# Altium schematic sheet LDO_AUX.SchDoc
size B; SheetNumber: 3; SheetTotal: 15
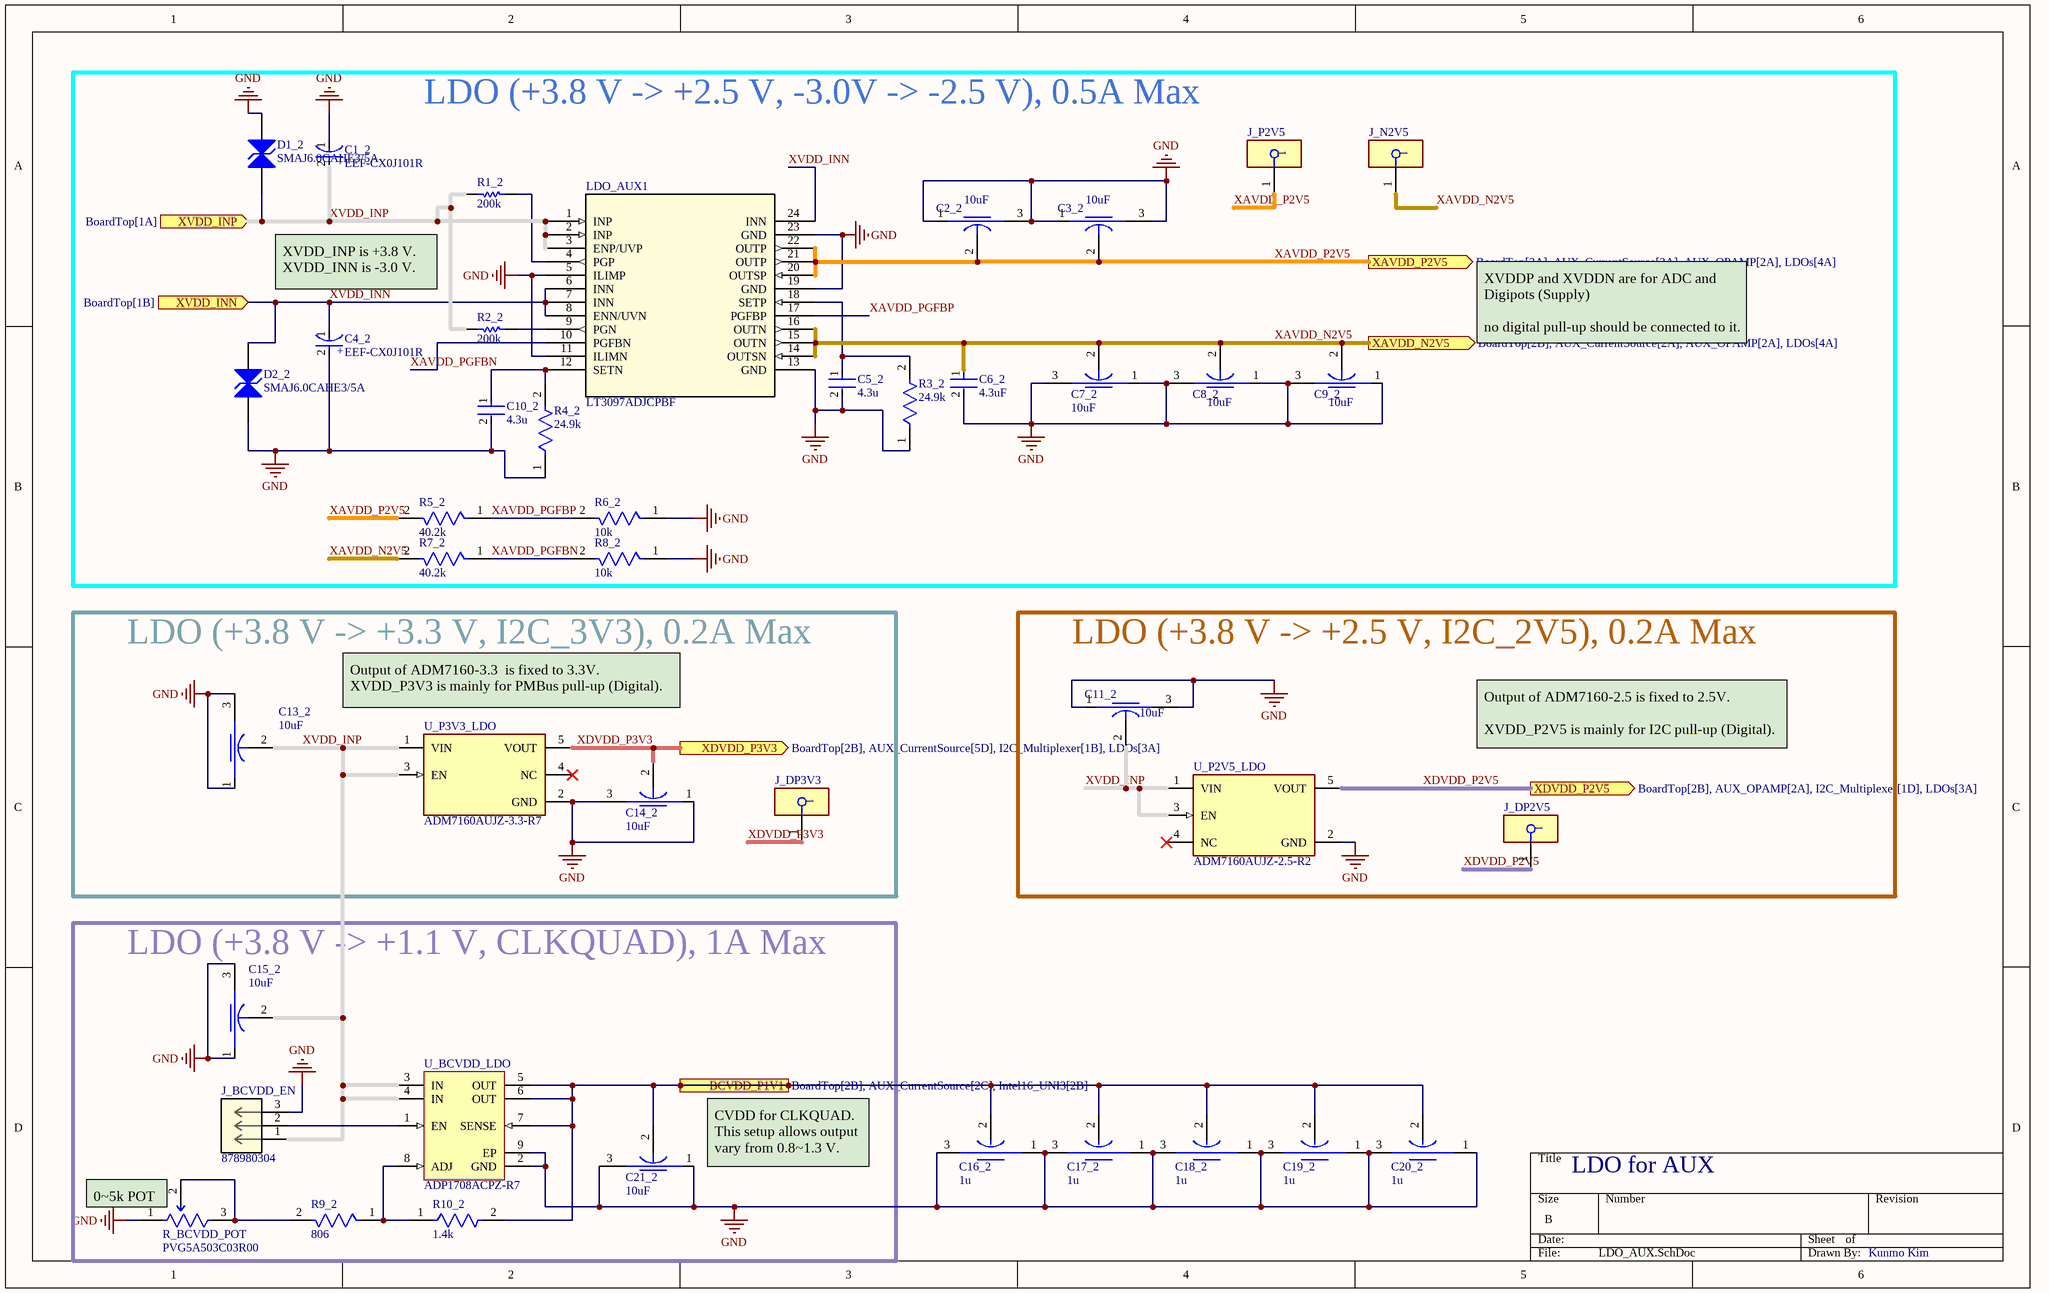
[diagram p0: LDO_AUX.SchDoc]

## Parts
C1_2  EEF-CX0J101R  [FP-CX-MFG]
C2_2  10uF  [FP-NFM15-0_2-MFG]
C3_2  10uF  [FP-NFM15-0_2-MFG]
C4_2  EEF-CX0J101R  [FP-CX-MFG]
C5_2  4.3u  [FP-LLL1U4-0_05-IPC_C]
C6_2  4.3uF  [FP-LLL1U4-0_05-MFG]
C7_2  10uF  [FP-NFM15-0_2-MFG]
C8_2  10uF  [FP-NFM15-0_2-MFG]
C9_2  10uF  [FP-NFM15-0_2-MFG]
C10_2  4.3u  [FP-LLL1U4-0_05-IPC_C]
C11_2  10uF  [FP-NFM15-0_2-MFG]
C13_2  10uF  [FP-NFM15-0_2-MFG]
C14_2  10uF  [FP-NFM15-0_2-MFG]
C15_2  10uF  [FP-NFM15-0_2-MFG]
C16_2  1u  [PCBComponent_1]
C17_2  1u  [PCBComponent_1]
C18_2  1u  [PCBComponent_1]
C19_2  1u  [PCBComponent_1]
C20_2  1u  [PCBComponent_1]
C21_2  10uF  [FP-NFM15-0_2-MFG]
D1_2  SMAJ6.0CAHE3/5A  [VISH-DO-214AC-2_L]
D2_2  SMAJ6.0CAHE3/5A  [VISH-DO-214AC-2_L]
J_BCVDD_EN  878980304  [CONN03_87898_M-5p84_MOL]
J_DP2V5  5019  [FP-5019-MFG]  (value not drawn)
J_DP3V3  5019  [FP-5019-MFG]  (value not drawn)
J_N2V5  5019  [FP-5019-MFG]  (value not drawn)
J_P2V5  5019  [FP-5019-MFG]  (value not drawn)
LDO_AUX1  LT3097ADJCPBF  [05-08-7071_ADI]
R1_2  200k  [RESC1005X40X25NL05T05]
R2_2  200k  [RESC1005X40X25NL05T05]
R3_2  24.9k  [FP-ERJ2RK-MFG]
R4_2  24.9k  [FP-ERJ2RK-MFG]
R5_2  40.2k  [FP-ERJ2RK-MFG]
R6_2  10k  [FP-ERA2A-MFG]
R7_2  40.2k  [FP-ERJ2RK-MFG]
R8_2  10k  [FP-ERA2A-MFG]
R9_2  806  [FP-ERJ2RK-MFG]
R10_2  1.4k  [FP-RT0603-MFG]
R_BCVDD_POT  PVG5A503C03R00  [FP-PVG5A-MFG]
U_BCVDD_LDO  ADP1708ACPZ-R7  [ADI-CP-8-2_N]
U_P2V5_LDO  ADM7160AUJZ-2.5-R2  [FP-UJ-5-IPC_A]
U_P3V3_LDO  ADM7160AUJZ-3.3-R7  [FP-UJ-5-IPC_A]

## Blocks framed on the sheet
LDO (+3.8 V -> +2.5 V, -3.0V -> -2.5 V), 0.5A Max: C1_2 C2_2 C3_2 C4_2 C5_2 C6_2 C7_2 C8_2 C9_2 C10_2 D1_2 D2_2 J_N2V5 J_P2V5 LDO_AUX1 R1_2 R2_2 R3_2 R4_2 R5_2 R6_2 R7_2 R8_2
LDO (+3.8 V -> +3.3 V, I2C_3V3), 0.2A Max: C13_2 C14_2 J_DP3V3 U_P3V3_LDO
LDO (+3.8 V -> +2.5 V, I2C_2V5), 0.2A Max: C11_2 J_DP2V5 U_P2V5_LDO
LDO (+3.8 V -> +1.1 V, CLKQUAD), 1A Max: C15_2 C21_2 J_BCVDD_EN R9_2 R10_2 R_BCVDD_POT U_BCVDD_LDO

## Ports
BCVDD_P1V1 (out, see BoardTop[2B], AUX_CurrentSource[2C], Intel16_UNI3[2B]), XAVDD_N2V5 (out, see BoardTop[2B], AUX_CurrentSource[2A], AUX_OPAMP[2A], LDOs[4A]), XAVDD_P2V5 (out, see BoardTop[2A], AUX_CurrentSource[2A], AUX_OPAMP[2A], LDOs[4A]), XDVDD_P2V5 (out, see BoardTop[2B], AUX_OPAMP[2A], I2C_Multiplexer[1D], LDOs[3A]), XDVDD_P3V3 (out, see BoardTop[2B], AUX_CurrentSource[5D], I2C_Multiplexer[1B], LDOs[3A]), XVDD_INN (in, see BoardTop[1B]), XVDD_INP (in, see BoardTop[1A])

## Nets
GND: C1_2.1(C) C2_2.1(Input) C2_2.3(Output) C3_2.1(Input) C3_2.3(Output) C4_2.2(A) C5_2.2 C6_2.2 C7_2.1(Input) C7_2.3(Output) C8_2.1(Input) C8_2.3(Output) C9_2.1(Input) C9_2.3(Output) C10_2.2 C11_2.1(Input) C11_2.3(Output) C13_2.1(Input) C13_2.3(Output) C14_2.1(Input) C14_2.3(Output) C15_2.1(Input) C15_2.3(Output) C16_2.1(Input) C16_2.3(Output) C17_2.1(Input) C17_2.3(Output) C18_2.1(Input) C18_2.3(Output) C19_2.1(Input) C19_2.3(Output) C20_2.1(Input) C20_2.3(Output) C21_2.1(Input) C21_2.3(Output) D1_2.2(A2) D2_2.1(A1) J_BCVDD_EN.3 LDO_AUX1.5(ILIMP) LDO_AUX1.11(ILIMN) LDO_AUX1.13(GND) LDO_AUX1.19(GND) LDO_AUX1.23(GND) R3_2.1 R4_2.1 R6_2.1 R8_2.1 R_BCVDD_POT.1(CCW) U_BCVDD_LDO.2(GND) U_BCVDD_LDO.9(EP) U_P2V5_LDO.2(GND) U_P3V3_LDO.2(GND)
BCVDD_P1V1: C16_2.2(GND) C17_2.2(GND) C18_2.2(GND) C19_2.2(GND) C20_2.2(GND) C21_2.2(GND) R10_2.2 U_BCVDD_LDO.5(OUT) U_BCVDD_LDO.6(OUT) U_BCVDD_LDO.7(SENSE) ; port BCVDD_P1V1
XAVDD_N2V5: C6_2.1 C7_2.2(GND) C8_2.2(GND) C9_2.2(GND) J_N2V5.1 LDO_AUX1.14(OUTSN) LDO_AUX1.15(OUTN) LDO_AUX1.16(OUTN) R7_2.2 ; port XAVDD_N2V5
XAVDD_P2V5: C2_2.2(GND) C3_2.2(GND) J_P2V5.1 LDO_AUX1.20(OUTSP) LDO_AUX1.21(OUTP) LDO_AUX1.22(OUTP) R5_2.2 ; port XAVDD_P2V5
XAVDD_PGFBN: LDO_AUX1.10(PGFBN) R7_2.1 R8_2.2
XAVDD_PGFBP: LDO_AUX1.17(PGFBP) R5_2.1 R6_2.2
XDVDD_P2V5: J_DP2V5.1 U_P2V5_LDO.5(VOUT) ; port XDVDD_P2V5
XDVDD_P3V3: C14_2.2(GND) J_DP3V3.1 U_P3V3_LDO.5(VOUT) ; port XDVDD_P3V3
XVDD_INN: C4_2.1(C) D2_2.2(A2) LDO_AUX1.6(INN) LDO_AUX1.7(INN) LDO_AUX1.8(ENN/UVN) LDO_AUX1.24(INN) ; port XVDD_INN
XVDD_INP: C1_2.2(A) C11_2.2(GND) C13_2.2(GND) C15_2.2(GND) D1_2.1(A1) J_BCVDD_EN.1 LDO_AUX1.1(INP) LDO_AUX1.2(INP) LDO_AUX1.3(ENP/UVP) R1_2.2 R2_2.2 U_BCVDD_LDO.3(IN) U_BCVDD_LDO.4(IN) U_P2V5_LDO.1(VIN) U_P2V5_LDO.3(EN) U_P3V3_LDO.1(VIN) U_P3V3_LDO.3(EN) ; port XVDD_INP
NetC5_2_1: C5_2.1 LDO_AUX1.18(SETP) R3_2.2
NetC10_2_1: C10_2.1 LDO_AUX1.12(SETN) R4_2.2
NetJ_BCVDD_EN_2: J_BCVDD_EN.2 U_BCVDD_LDO.1(EN)
NetLDO_AUX1_4: LDO_AUX1.4(PGP) R1_2.1
NetLDO_AUX1_9: LDO_AUX1.9(PGN) R2_2.1
NetR9_2_1: R9_2.1 R10_2.1 U_BCVDD_LDO.8(ADJ)
NetR9_2_2: R9_2.2 R_BCVDD_POT.2(WIPER) R_BCVDD_POT.3(CW)

Not connected (* = marked no-connect by the designer): U_P2V5_LDO 4(NC)*; U_P3V3_LDO 4(NC)*

## Notes on the sheet
- XVDD_INP is +3.8 V.
  XVDD_INN is -3.0 V.
- XVDDP and XVDDN are for ADC and Digipots (Supply)
  no digital pull-up should be connected to it.
- (near U_P3V3_LDO) Output of ADM7160-3.3  is fixed to 3.3V.
  XVDD_P3V3 is mainly for PMBus pull-up (Digital).
- Output of ADM7160-2.5 is fixed to 2.5V.
  XVDD_P2V5 is mainly for I2C pull-up (Digital).
- (near C21_2) CVDD for CLKQUAD.
  This setup allows output
  vary from 0.8~1.3 V.
- LDO for AUX
- (near R_BCVDD_POT) 0~5k POT
- Kunmo Kim
- (in symbol CMP-05427-000056-1) +

## Library data of the parts
C1_2 C4_2 = CMP-05427-000056-1: CAP ALUM POLY 100UF 20% 6.3V SMD; Leakage Current: 63uA; Polarity: Polar; Lead Diameter: 2.4mm; Dissipation Factor: 0.06%; Ripple Current: 2.7A; ESR (Equivalent Series Resistance): 15mR; Life (Hours): 1000Hour; Voltage Rating: 6.3V; Case/Package: 2917; Lead Pitch: 1.3mm; Series: SP-Cap CX; Weight: 0.004586oz; Radiation Hardening: No; Case Code (Imperial): 2917; Length: 7.3mm; Number of Pins: 2; Lead Free: Lead Free; REACH SVHC: No SVHC; Max Operating Temperature: 105°C; Package Quantity: 3500; Packaging: Tape and Reel; Height - Seated (Max): 0.075inch; Mount: Surface Mount; Height: 1.9mm; Termination: SMD/SMT; Voltage: 6.3V; Construction: Flat; Width: 0.169inch; Ripple Current (AC): 2.7A; Capacitance: 100uF; Voltage Rating (DC): 6.3V; Case Code (Metric): 7343; Min Operating Temperature: -40°C; Tolerance: 20%; RoHS Compliant: Yes; Depth: 4.3mm
C2_2 C3_2 C7_2 C8_2 C9_2 C11_2 C13_2 C14_2 C15_2 C21_2 = CMP-06053-000058-1: CAP FEEDTHRU
C5_2 C6_2 C10_2 = CMP-06035-061933-1: Cap Ceramic Monolithic 4.3uF 20% 4V X5R 15% 02404 (0610M); Capacitance: 4.3uF; Tolerance: 20%; Voltage Rating: 4V; Min Operating Temperature: -55°C; Case/Package: 0204; Mount: Surface Mount; Max Operating Temperature: 85°C; Packaging: Tape and Reel; RoHS Compliant: Yes
C16_2 C17_2 C18_2 C19_2 C20_2 = CMP-06053-000757-1: 0402(1005M) 4V 1.0UF +/- 20% 3 T; Capacitance: 1uF; Current: 2A; Case/Package: 0402; Max Operating Temperature: 125°C; Min Operating Temperature: -55°C; Mount: Surface Mount; Ratings: AEC-Q200; Series: EMIFIL®, NFM15; Tolerance: 20%; Voltage Rating: 4V; Supplier 1: Mouser; Supplier Part Number 1: 81-NFM15HC105D0G3D
D1_2 D2_2 = CMP-0548-00108-2: Transient Voltage Suppressor, 6.40 to 231 V, 6 V Stand-off Voltage, Bi-Directional, -55 to 155 degC, 2-pin DO-214AC, Pb-Free, Tape and Reel; Manufacturer: Vishay Semiconductor; VBR Bi-Directional (V): 6.4 to 231; VWM (V): 6; IFSM: 40 A; ID (uA): 1600; PPPM (W): 400, 300; PackageDescription: 2-Pin DO-214AC (SMA), Body 4.245 x 2.665 mm; Packing: Tape and Reel; RoHS: TRUE; ComponentLink3Description: Package Specification; ComponentLink2Description: Datasheet; Mounting Technology: Surface Mount; Operating Junction and Storage Temperature Range: -55 to 150 degC; ComponentLink2URL: http://www.vishay.com/docs/88390/smaj50a.pdf; ComponentLink1Description: Manufacturer URL; DatasheetVersion: 12/8/2013; PackageReference: DO-214AC-2; ComponentLink3URL: http://www.vishay.com/docs/88390/smaj50a.pdf; PartNumber: SMAJ6.0CAHE3/5A; ComponentLink1URL: http://www.vishay.com/; Supplier 1: Mouser; Supplier Part Number 1: 78-SMAJ6.0CAHE3_A/H
J_BCVDD_EN = 878980304: No Description Available; Mfr_Name: Molex Connector Corporation; RefDes: RefDes; Type: Type
J_DP2V5 J_DP3V3 J_N2V5 J_P2V5 = CMP-1672-00008-2: NexarPartId: 22052288; Number of Contacts: 1; Contact Material: Bronze, Silver; Number of Pins: 1; Lead Free: Lead Free; Packaging: Tape and Reel; Mount: Surface Mount; Height: 2.286mm; Contact Plating: Silver; Material: Bronze; Termination: SMD/SMT; REACH SVHC: No SVHC; RoHS: Compliant
LDO_AUX1 = LT3097ADJCPBF: No Description Available; Mfr_Name: Analog Devices Inc; Type: Power Management; RefDes: RefDes; Supplier 1: Mouser; Supplier Part Number 1: 584-LT3097ADJC#PBF
R1_2 R2_2 = CMP-1011-00768-4: Chip Resistor, 200 KOhm, +/- 1%, 100 mW, -55 to 155 degC, 0402 (1005 Metric), RoHS, Tape and Reel; PartNumber: ERJ-2RKF2003X; Manufacturer: Basic Passives; Case\/Package: 0402; Voltage Rating: 50 V; Power Rating: 100 mW; RoHSCompliant: true; Length: 1 mm; DatasheetVersion: 04/2015; ComponentLink2URL: http://industrial.panasonic.com/cdbs/www-data/pdf/RDA0000/AOA0000C86.pdf; Mount: Surface Mount; PackageDescription: 2-Pin Surface Mount Device, Body 1 x 0.5 mm; Tolerance: 1%; Width: 0.5 mm; ComponentLink2Description: Datasheet; Packaging: Tape and Reel; REACH SVHC: No SVHC; Min Operating Temperature: -55 degC; Package Quantity: 10000; ComponentLink1Description: Manufacturer URL; Height: 0.35 mm; ComponentLink1URL: http://www.panasonic.com/; Mounting Technology: Surface Mount; Case Code (Imperial): 0402; PackageReference: 0402; Radiation Hardening: No; Pins: 2; Max Operating Temperature: 155 degC; Resistance: 200 KOhm; Case Code (Metric): 1005
R3_2 R4_2 = CMP-2002-00806-2: RES SMD 24.9K OHM 1% 1/10W 0402; Voltage Rating (DC): 50V; Temperature Coefficient: 100ppm/°C; Max Power Dissipation: 100mW; Resistance: 24.9kR; Size Code: 0402; Series: ERJ; Package Quantity: 1; Packaging: Tape and Reel; Lead Free: Lead Free; Mount: Surface Mount; Construction: Rectangular; Depth: 0.5mm; Contact Plating: Tin; Length: 1mm; Termination: SMD/SMT; Height: 0.016inch; Military Standard: Not; Voltage Rating: 50V; Resistor Type: Thick Film; Number of Terminations: 2; Case/Package: 0402; REACH SVHC: No SVHC; Case Code (Metric): 1005; Power Rating: 100mW; Tolerance: 1%; Weight: 2.8E-05oz; RoHS Compliant: Yes; Case Code (Imperial): 0402; Max Operating Temperature: 155°C; Features: Automotive AEC-Q200; Width: 0.02inch; Resistance Tolerance: 1%; Min Operating Temperature: -55°C
R5_2 R7_2 = CMP-2002-00919-2: RES SMD 40.2K OHM 1% 1/10W 0402; Max Power Dissipation: 100mW; Voltage Rating (DC): 50V; Temperature Coefficient: 100ppm/°C; Resistance: 40.2kR; Case Code (Metric): 1005; REACH SVHC: No SVHC; Height: 0.35mm; Mount: Surface Mount; Series: ERJ; Width: 0.02inch; Contact Plating: Tin; Number of Terminations: 2; Max Operating Temperature: 155°C; Length: 1mm; Case Code (Imperial): 0402; Construction: Rectangular; Depth: 0.5mm; Features: Automotive AEC-Q200; Weight: 2.8E-05oz; Power Rating: 100mW; Lead Free: Lead Free; Case/Package: 0402; Resistor Type: Thick Film; Termination: SMD/SMT; Voltage Rating: 50V; Package Quantity: 1; Packaging: Tape and Reel; Min Operating Temperature: -55°C; Resistance Tolerance: 1%; Military Standard: Not; Tolerance: 1%; Technology: THICK FILM; RoHS Compliant: Yes
R6_2 R8_2 = CMP-2002-05875-2: RES SMD 10K OHM 0.1% 1/16W 0402; Manufacturer Part Number: ERA-2AEB103X; Manufacturer: Panasonic; Temperature Coefficient: 25ppm/°C; Automotive Grade: Grade 0; Resistance: 10kΩ; Power Rating: 0.063W; Voltage Rating: 50V; Value: 10kΩ; RoHS: TRUE; Device Class L3: Chip SMD Resistors; Automotive: Yes; Series: ERA; Height: 0.4mm; Package: ERA2A; Temperature Range Low: -55°C; ComponentLink2Description: Datasheet; Tolerance: 0.1%; Device Class L2: Resistors; Temperature Range High: +155°C; Device Class L1: Passive Components; Digikey Description: RES SMD 10K OHM 0.1% 1/16W 0402; Category: Res; Mouser Description: Thin Film Resistors - SMD 0402 1/16W 10Kohms; Lead Free: Yes; Footprint Url: https://industrial.panasonic.com/cdbs/www-data/pdf/RDM0000/DMM0000COL17.pdf; Composition: Metal Film; Octopart: https://octopart.com/era-2aeb103x-panasonic-9251377; ComponentLink2URL: https://industrial.panasonic.com/cdbs/www-data/pdf/RDM0000/AOA0000C307.pdf; Temperature: -55°C to +155°C
R9_2 = CMP-2002-01074-4: RES SMD 80.6K OHM 1% 1/10W 0402; NexarPartId: 55421299; Max Power Dissipation: 100mW; Temperature Coefficient: 100ppm/°C; Voltage Rating: 50V; Resistance: 80.6kΩ; Length: 1mm; Number of Terminations: 2; REACH SVHC: No SVHC; Composition: Thick Film; Case Code (Imperial): 0402; RoHS: Compliant; Max Operating Temperature: 155°C; Military Standard: Not; Case Code (Metric): 1005; Depth: 500µm; Termination: SMD/SMT; Contact Plating: Tin; Tolerance: 1%; Voltage Rating (DC): 50V; Min Operating Temperature: -55°C; Case/Package: 0402; Schedule B: 8533210045, 8533210045; Height: 400µm; Power Rating: 100mW; Packaging: Cut Tape (CT); Features: Automotive AEC-Q200; Lead Free: Lead Free; Width: 508µm; Lifecycle Status: Production; Mount: Surface Mount
R10_2 = CMP-03412-033782-1: RES SMD 1.4K OHM 0.1% 1/10W 0603; Manufacturer Part Number: RT0603BRD071K4L; Manufacturer: Yageo; Tolerance: 0.001; Voltage Rating: 75V; Temperature Coefficient: 25 ppm/°C; Resistance: 1.4KΩ; Value: 1.4KΩ; Power Rating: 0.1W; Device Class L3: Chip SMD Resistors; Package: RT0603; RoHS: TRUE; Lead Free: Yes; Footprint Url: http://www.yageo.com/exep/pages/download/literatures/PYu-R_Mount_10.pdf; Device Class L2: Resistors; Ipc Land Pattern Name: RESC16080X45; Digikey Description: RES SMD 1.4K OHM 0.1% 1/10W 0603; ComponentLink2Description: Datasheet; Category: Res; Mouser Description: Res Thin Film 0603 1.4k Ohm 0.1% 1/10W ±25ppm/°C Molded SMD Paper T/R; Temperature: -55°C to +155°C; Temperature Range High: +155°C; Octopart: https://octopart.com/rt0603brd071k4l-yageo-1419726; Device Class L1: Passive Components; ComponentLink2URL: http://www.yageo.com/documents/recent/PYu-RT_1-to-0.01_RoHS_L_9.pdf; Series: RT; Height: 0.55mm; Composition: Thin Film; Temperature Range Low: -55°C; Automotive: No
R_BCVDD_POT = CMP-00059-71526922-1: PVG5A502C03R00 Resistor Trimmer, Cermet, 5 kOhm, ± 10%, 250 mW, 12 Turn, Multi Turn, Surface Mount; Temperature Coefficient: 150ppm/°C; Power Rating: 250mW; Resistance: 5kΩ; Number of Turns: 11; Schedule B: 8533400080, 8533400080|8533400080|8533400080|8533400080|8533400080; RoHS: Compliant; Height: 5.1054mm; Max Operating Temperature: 125°C; Min Operating Temperature: -55°C; Mount: Surface Mount; Max Power Dissipation: 250mW; NexarPartId: 71526922; Tolerance: 10%; Composition: Cermet
U_BCVDD_LDO = CMP-0786-00092-1: 1 A, Low Dropout, CMOS Linear Regulator, 2.5 to 5.5 V Vin, 0.8 to 5 V Vout, Industrial, 8-pin QFN (CP-8-2), Reel; Manufacturer: Analog Devices; Vin (max) (V): 5.5; Iout max: 1A; Vin (min) (V): 2.5; Vout Adjustable Range: 0.8V to 5V; Supply Current IGND @ Small Load: 50uA; ComponentLink4Description: URL Link1; Packing: Reel; ComponentLink2Description: Datasheet; ComponentLink1URL: http://www.analog.com/en/index.html; PackageVersion: 061507-B, 06/2007; PartNumber: ADP1708ACPZ-R7; Mounting Technology: Surface Mount; PackageReference: CP-8-2; PackageDescription: 8-Pin Lead Frame Chip Scale Package, Body 3 x 3 mm, Pitch 0.5 mm; DatasheetVersion: Rev. 0; ComponentLink1Description: Manufacturer URL; ComponentLink2URL: http://www.analog.com/static/imported-files/data_sheets/ADP1706_1707_1708.pdf; ComponentLink3Description: Package Specification; ComponentLink3URL: http://www.analog.com/static/imported-files/packages/56953322593982CP_8_2.pdf; ComponentLink4URL: Product URL:http://www.analog.com/en/ADP1708/productSearch.html
U_P2V5_LDO = CMP-09138-000128-1: IC REG LINEAR 2.5V 200MA TSOT5; Number of Outputs: 1; Max Supply Current: 265uA; Min Input Voltage: 2.2V; Accuracy: 1%; Polarity: Positive; Quiescent Current: 10uA; Max Input Voltage: 5.5V; Power Supply Rejection Ratio (PSRR): 49dB; Output Type: Fixed; Dropout Voltage: 150mV; Min Current Limit: 220mA; Output Current: 200mA; Number of Regulators: 1; Case/Package: TSOT; Max Output Current: 200mA; Nominal Output Voltage: 2.5V; Mount: Surface Mount; Output Voltage: 2.5V; Max Operating Temperature: 125°C; Contact Plating: Tin; REACH SVHC: No SVHC; Min Operating Temperature: -40°C; Packaging: Tape and Reel; Number of Pins: 5; RoHS Compliant: Yes; Lead Free: Contains Lead
U_P3V3_LDO = CMP-09138-000051-1: IC REG LINEAR 3.3V 200MA TSOT5; Min Current Limit: 220mA; Dropout Voltage: 150mV; Number of Outputs: 1; Max Input Voltage: 5.5V; Power Supply Rejection Ratio (PSRR): 49dB; Polarity: Positive; Max Supply Current: 265uA; Accuracy: 1%; Min Input Voltage: 2.2V; Output Type: Fixed; Quiescent Current: 10uA; Mount: Surface Mount; Output Voltage: 3.3V; RoHS Compliant: Yes; Lead Free: Contains Lead; Max Operating Temperature: 125°C; Case/Package: TSOT; Number of Pins: 5; Number of Regulators: 1; Max Output Current: 200mA; Min Operating Temperature: -40°C; Output Current: 200mA; Packaging: Tape and Reel; Contact Plating: Tin